# EAGLE design single-apa102c (EAGLE 9.6.2)

## Sheet 1 of 2
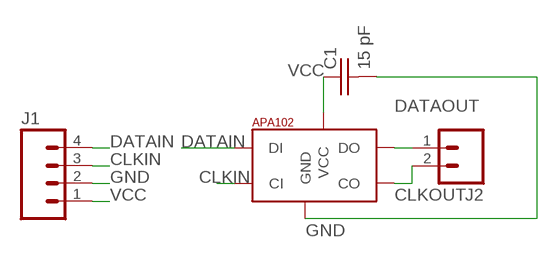
[diagram p0: schematic, sheet 1]

### Parts
C1  15 pF  C-USC0805K  [C0805K]
J1  M04PTH  [1X04]
J2  M02PTH  [1X02]
U$1  APA1025050  [APA102_5050]

### Nets
CLKIN: J1.3 U$1.5(CI)
CLKOUT: J2.2 U$1.2(CO)
DATAIN: J1.4 U$1.4(DI)
DATAOUT: J2.1 U$1.3(DO)
GND: C1.2 J1.2 U$1.6(GND)
VCC: C1.1 J1.1 U$1.1(VCC)

## Sheet 2 of 2
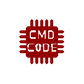
[diagram p1: schematic, sheet 2]

### Parts
U$2  CMD_C0DE_LOGOCMD_CODE_LOGO_TOP_COPPER  [CMD_C0DE_LOGO_TOP_COPPER]

## Library data of the parts
C1 = passives:C-US: CAPACITOR, American symbol
J1 = connector:M04: Header 4 Standard 4-pin 0.1" header. Use with straight break away headers (SKU : PRT-00116), right angle break away headers (PRT-00553), swiss pins (PRT-00743), machine pins (PRT-00117), and female headers (PRT-00115). Molex polarized connector foot print use with SKU : PRT-08231 with associated crimp pins and housings. 1MM SMD Version SKU: PRT-10208; PROD_ID: CONN-09696
J2 = connector:M02: Standard 2-pin 0.1" header. Use with - straight break away headers ( PRT-00116) - right angle break away headers (PRT-00553) - swiss pins (PRT-00743) - machine pins (PRT-00117) - female headers (PRT-00115) Molex polarized connector foot print use with: PRT-08233 with associated crimp pins and housings. 2.54_SCREWTERM for use with PRT-10571. 3.5mm Screw Terminal footprints for PRT-08084 5mm Screw Terminal footprints for use with PRT-08432
U$1 = leds:APA102: APA102C 5050 RGB LED -- Adafruit DotStar Single LED Pixel Product Page: https://www.adafruit.com/products/2343 Datasheet: https://cdn-shop.adafruit.com/product-files/2343/APA102C.pdf
U$2 = logos:CMD_C0DE_LOGO

## Board
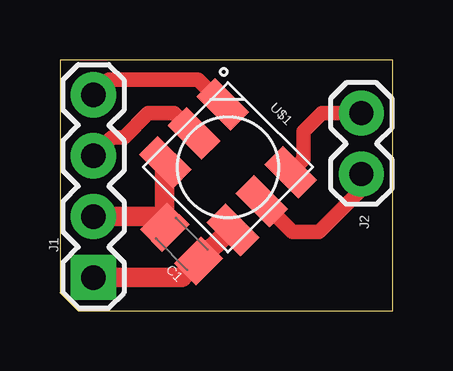
[diagram p2: board, top side]
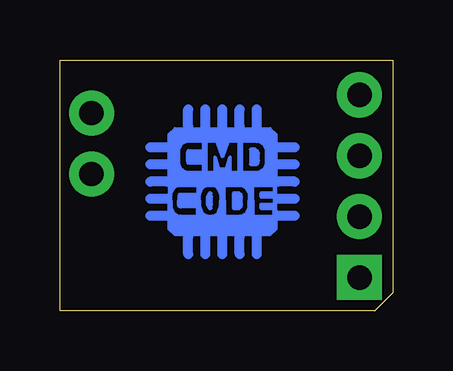
[diagram p3: board, bottom side, seen from below]

Size 13.89 x 10.48 mm. Coordinates in mm from the lower left corner, seen from the top.
Outline: 0.76,0 13.89,0 13.89,10.48 0,10.48 0,0.76 0.76,0
Copper layers (1*16): Top 0.035mm / dielectric 1.5mm / Bottom 0.035mm
Design rules "OthermillDRC_1_64_v2": minimum track width 16mil, minimum drill 31mil, track to track 0.39878125mm, track to pad 0.39878125mm, pad to pad 0.39878125mm, via to via 0.39878125mm, smd to smd 0mil, copper to edge 0mil, drill to drill 1mil, minimum pad ring 0mil, minimum via ring 15mil, stop-mask expansion 1mil, vias tented up to drill 30mil, thermal gap 10mil

### Footprints (pad centres in the part's own frame; a part is rotated, then mirrored left to right if it is on the bottom)
C0805K = smd 1.3 x 1.6: 1 -1,0; 2 1,0
1X04 = drill 1.016 pad 1.88 square: 1 0,0 | drill 1.016 pad 1.88: 2 2.54,0; 3 5.08,0; 4 7.62,0
1X02 = drill 1.016 pad 1.88: 1 0,0; 2 2.54,0
APA102_5050 = smd 2 x 1.1: 1 2,-1.7; 2 2,0; 3 2,1.7; 4 -2,1.7; 5 -2,0; 6 -2,-1.7

### Placement (x,y rotation side)
C1  5.08,2.79 135 top
J1  1.4,1.4 90 top
J2  12.57,8.26 270 top
U$1  7.01,6 315 top
U$2  7.11,5.71 0 bottom

### Tracks (layer width: path | path; a pad name or v marks a point on that pad's centre or on a via)
CLKIN
  Top 0.61: J1.3 2.16,7.24 2.67,7.24 3.68,8.26 4.75,8.26 U$1.5
CLKOUT
  Top 0.61: U$1.2 9.71,3.3 10.79,3.3 12.57,5.08 J2.2
DATAIN
  Top 0.61: J1.4 2.03,9.65 5.76,9.65 U$1.4
DATAOUT
  Top 0.61: U$1.3 10.16,6.32 10.16,7.49 10.92,8.26 J2.1
GND
  Top 0.813: J1.2 3.94,3.94 C1.2 4.37,6.19 U$1.6
VCC
  Top 0.813: J1.1 5.1,1.4 C1.1 7.08,3.38 U$1.1